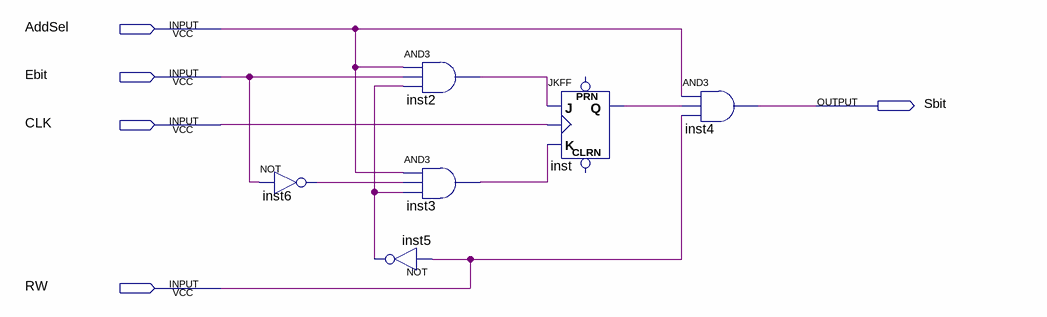
[diagram p0: schematic sheet]
// Quartus schematic Celula.bdf as structural Verilog: 6 symbols, 5 pins
module Celula (
  input  AddSel,
  input  Ebit,
  input  CLK,
  input  RW,
  output Sbit
);

  wire inst2_out, inst3_out, inst5_out, inst6_out, inst_q;

  not inst6 (inst6_out, Ebit);
  not inst5 (inst5_out, RW);
  and inst2 (inst2_out, AddSel, Ebit, inst5_out);
  and inst3 (inst3_out, AddSel, inst6_out, inst5_out);
  JKFF inst (.K(inst3_out), .J(inst2_out), .CLK(CLK), .Q(inst_q));  // open: PRN, CLRN
  and inst4 (Sbit, AddSel, inst_q, RW);
endmodule
